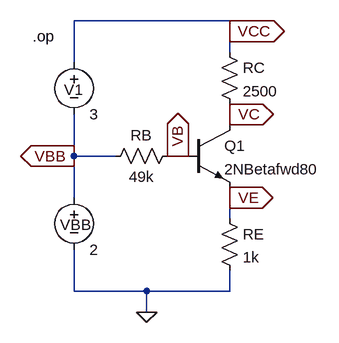
[diagram p0: schematic prob5_30b.asc]
prob5_30b.asc, the LTspice schematic file:
Version 4
SHEET 1 880 680
WIRE 240 -16 0 -16
WIRE 240 0 240 -16
WIRE 240 32 240 0
WIRE 0 48 0 -16
WIRE 240 128 240 112
WIRE 240 144 240 128
WIRE 0 192 0 128
WIRE 64 192 0 192
WIRE 160 192 144 192
WIRE 176 192 160 192
WIRE 0 256 0 192
WIRE 240 256 240 240
WIRE 240 288 240 256
WIRE 0 400 0 336
WIRE 112 400 0 400
WIRE 240 400 240 368
WIRE 240 400 112 400
WIRE 112 432 112 400
FLAG 240 0 VCC
IOPIN 240 0 Out
FLAG 240 128 VC
IOPIN 240 128 Out
FLAG 240 256 VE
IOPIN 240 256 Out
FLAG 160 192 VB
IOPIN 160 192 Out
FLAG 0 192 VBB
IOPIN 0 192 Out
FLAG 112 432 0
SYMBOL npn 176 144 R0
SYMATTR InstName Q1
SYMATTR Value 2NBetafwd80
SYMBOL voltage 0 32 R0
WINDOW 0 -15 58 Left 2
SYMATTR InstName V1
SYMATTR Value 3
SYMBOL voltage 0 240 R0
WINDOW 0 -21 58 Left 2
SYMATTR InstName VBB
SYMATTR Value 2
SYMBOL res 224 16 R0
SYMATTR InstName RC
SYMATTR Value 2500
SYMBOL res 160 176 R90
WINDOW 0 0 56 VBottom 2
WINDOW 3 32 56 VTop 2
SYMATTR InstName RB
SYMATTR Value 49k
SYMBOL res 224 272 R0
SYMATTR InstName RE
SYMATTR Value 1k
TEXT -64 8 Left 2 !.op

The netlist it stands for:
* prob5_30b.asc
Q1 VC VB VE 0 2NBetafwd80
V1 VCC VBB 3
VBB VBB 0 2
RC VCC VC 2500
RB VB VBB 49k
RE VE 0 1k
.model NPN NPN
.model PNP PNP
.lib standard.bjt
.op
.backanno
.end

* Results of the author's LTspice run, read from the files saved beside the schematic
* Operating Point:
*   V(vc) = 2.915 V
*   V(vb) = 1.495 V
*   V(ve) = 844.5 mV
*   V(vcc) = 5 V
*   V(vbb) = 2 V
*   Ic(Q1) = 834.1 µA
*   Ib(Q1) = 10.31 µA
*   Ie(Q1) = -844.5 µA
*   I(Rc) = 834.1 µA
*   I(Rb) = -10.31 µA
*   I(Re) = 844.5 µA
*   I(V1) = -834.1 µA
*   I(Vbb) = -844.5 µA